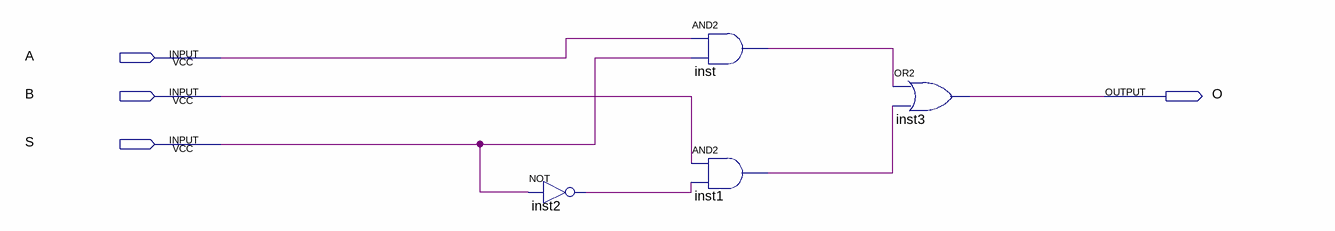
[diagram p0: schematic sheet]
// Quartus schematic mux2to1.bdf as structural Verilog: 4 symbols, 4 pins
module mux2to1 (
  input  A,
  input  B,
  input  S,
  output O
);

  wire inst1_out, inst2_out, inst_out;

  not inst2 (inst2_out, S);
  and inst (inst_out, A, S);
  and inst1 (inst1_out, B, inst2_out);
  or inst3 (O, inst_out, inst1_out);
endmodule
